# Altium project mo_rong_LoRa_RS485_V2.PrjPcb
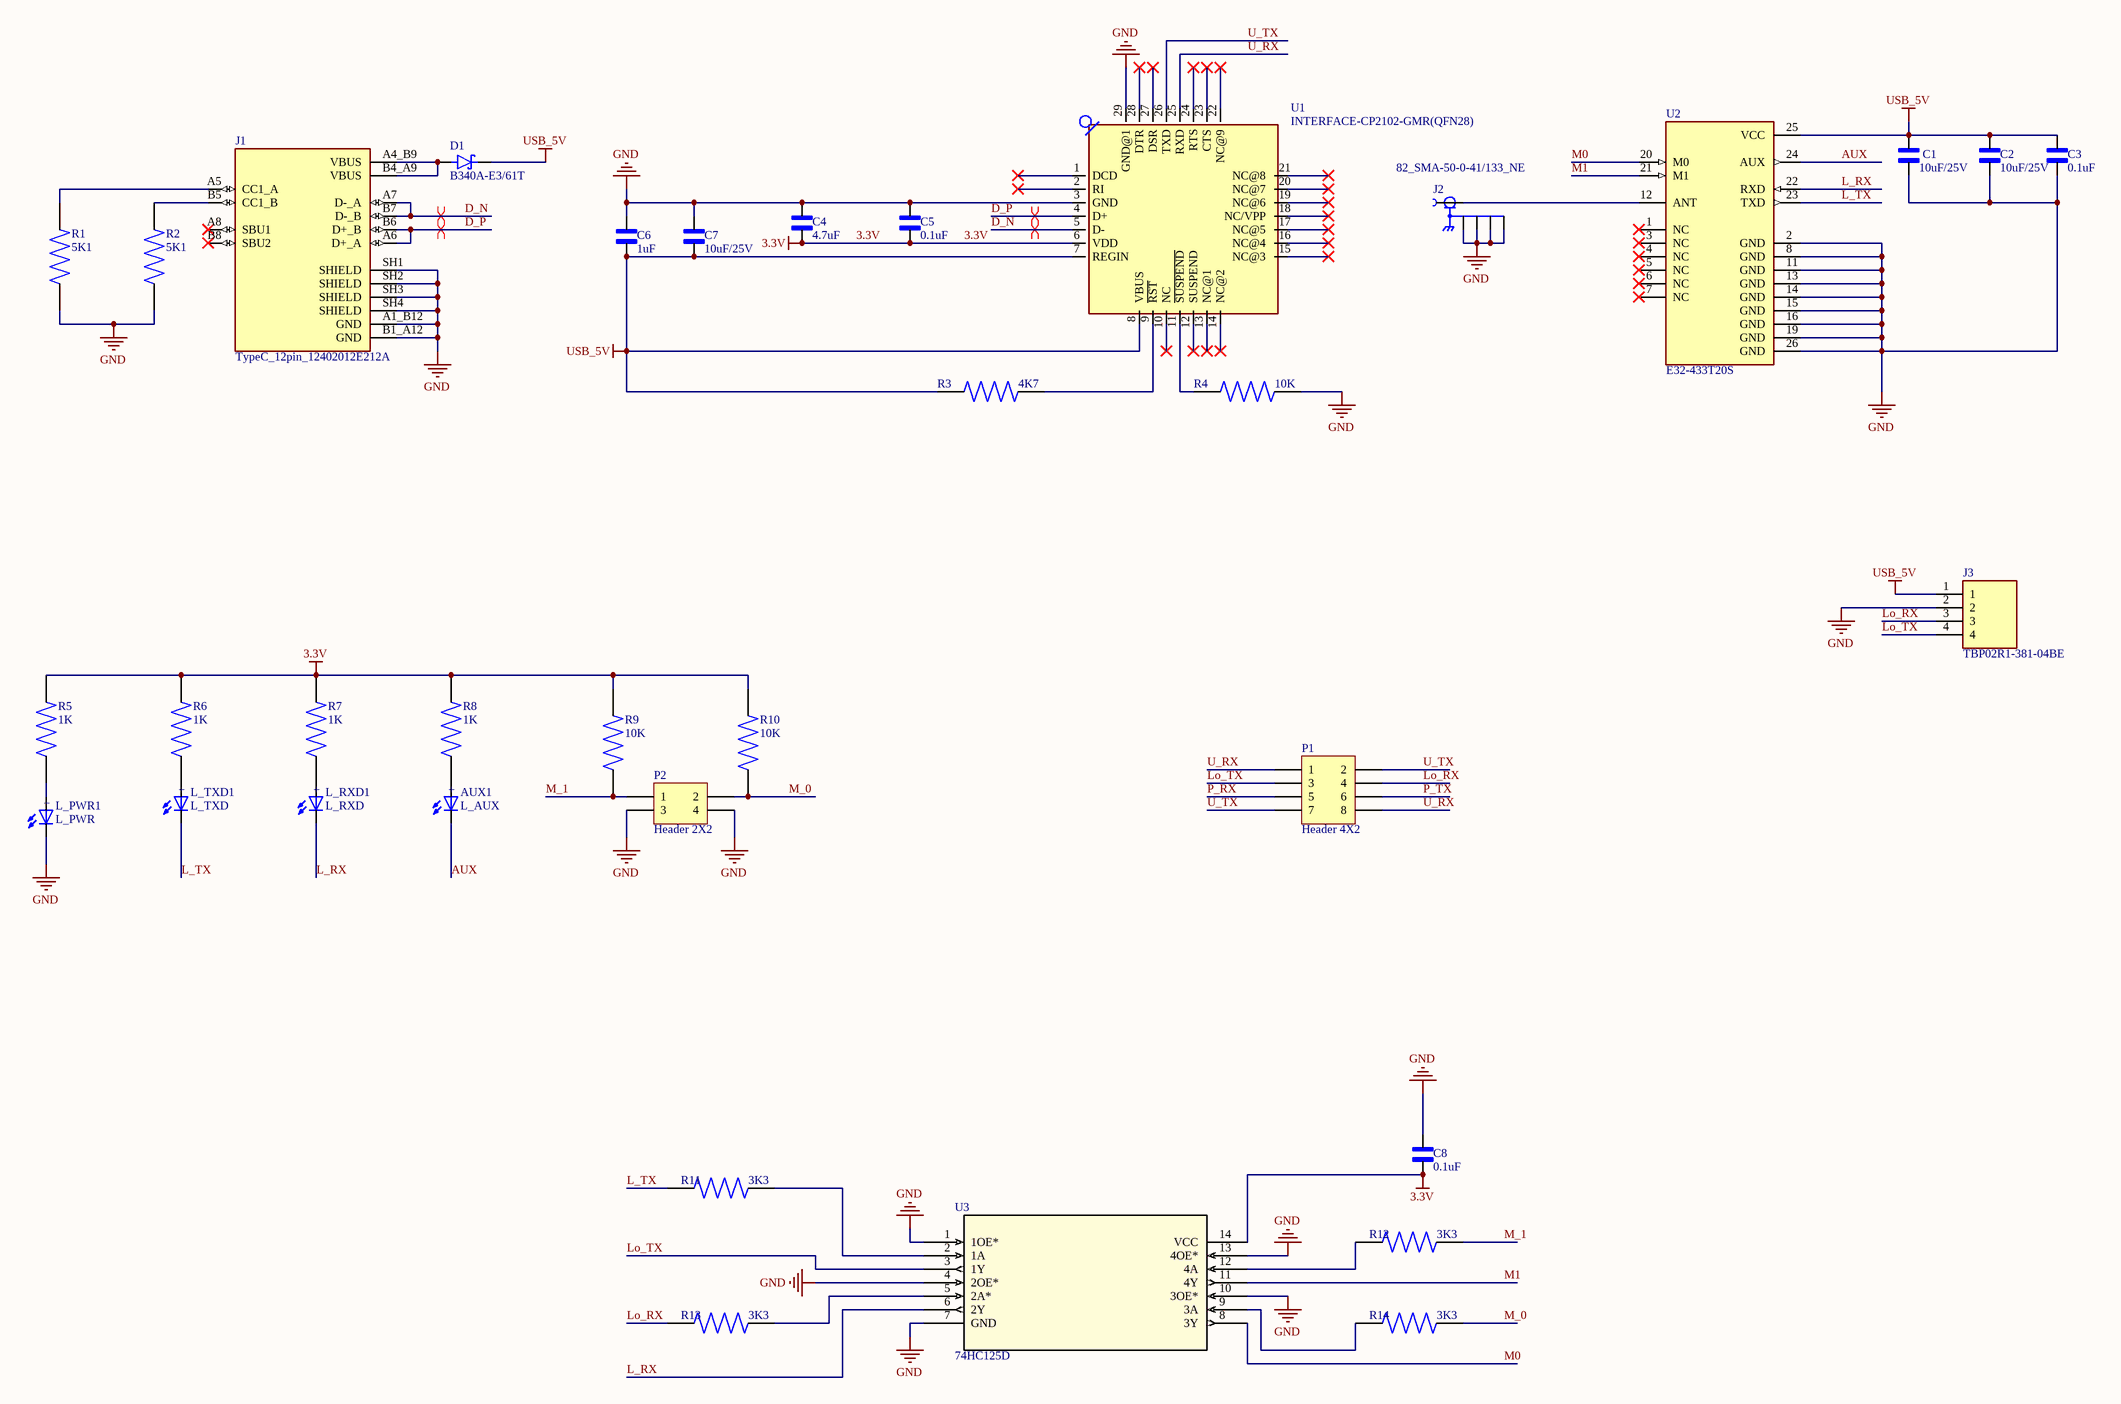
[diagram p0: LoRa_V.SchDoc]
3 sheets, 128 parts. Net scope: global (net labels, ports and power ports of the same name join across sheets).
Board file: mach_mo_rong_v2.PcbDoc
Sheets:
  LoRa_V.SchDoc
  RS_485_V.SchDoc
  connect.SchDoc

## Sheet LoRa_V.SchDoc
size C; SheetNumber: 1; SheetTotal: 3

### Parts
AUX1  L_AUX  [WL-SMCW_1206]
C1  10uF/25V  [CAPC1608X94N]
C2  10uF/25V  [CAPC1608X94N]
C3  0.1uF  [CAPC1608X94N]
C4  4.7uF  [CAPC1608X94N]
C5  0.1uF  [CAPC1608X94N]
C6  1uF  [CAPC1608X94N]
C7  10uF/25V  [CAPC1608X94N]
C8  0.1uF  [CAPC1608X94N]
D1  B340A-E3/61T  [DIOM5126X229N]
J1  TypeC_12pin_12402012E212A  [TypeC_12pin_12402012E212A]
J2  82_SMA-50-0-41/133_NE  [HUBER+SUHNER_82_SMA-50-0-41/133_NE]
J3  TBP02R1-381-04BE  [CUI_TBP02R1-381-04BE]
L_PWR1  L_PWR  [WL-SMCW_1206]
L_RXD1  L_RXD  [WL-SMCW_1206]
L_TXD1  L_TXD  [WL-SMCW_1206]
P1  Header 4X2  [HDR2X4]
P2  Header 2X2  [HDR2X2]
R1  5K1  [RES_ERJU03J474V]
R2  5K1  [RES_ERJU03J474V]
R3  4K7  [RES_ERJU03J474V]
R4  10K  [RES_ERJU03J474V]
R5  1K  [RES_ERJU03J474V]
R6  1K  [RES_ERJU03J474V]
R7  1K  [RES_ERJU03J474V]
R8  1K  [RES_ERJU03J474V]
R9  10K  [RES_ERJU03J474V]
R10  10K  [RES_ERJU03J474V]
R11  3K3  [RES_ERJU03J474V]
R12  3K3  [RES_ERJU03J474V]
R13  3K3  [RES_ERJU03J474V]
R14  3K3  [RES_ERJU03J474V]
U1  INTERFACE-CP2102-GMR(QFN28)  [QFN28G_0.5-5X5MM]
U2  E32-433T20S  [MODULE_E32-433T20S]
U3  74HC125D  [SOT108-1_NEX]

### Nets
3.3V: C4.1 C5.1 C8.2 R5.2 R6.2 R7.2 R8.2 R9.1 R10.1 U1.6(VDD) U3.14(VCC)
GND: C1.1 C2.1 C3.1 C4.2 C5.2 C6.2 C7.2 C8.1 J1.A1_B12(GND) J1.B1_A12(GND) J1.SH1(SHIELD) J1.SH2(SHIELD) J1.SH3(SHIELD) J1.SH4(SHIELD) J2.G1 J2.G2 J2.G3 J2.G4 J3.2 L_PWR1.1(NEG) P2.3 P2.4 R1.1 R2.1 R4.2 U1.3(GND) U1.29(GND@1) U2.2(GND) U2.8(GND) U2.11(GND) U2.13(GND) U2.14(GND) U2.15(GND) U2.16(GND) U2.19(GND) U2.26(GND) U3.1(1OE*) U3.4(2OE*) U3.7(GND) U3.10(3OE*) U3.13(4OE*)
USB_5V: C1.2 C2.2 C3.2 C6.1 C7.1 D1.C J3.1 R3.1 U1.7(REGIN) U1.8(VBUS) U2.25(VCC)  [project net RPI_5V]
AUX: AUX1.1(NEG) U2.24(AUX)
D_N: J1.A7(D-_A) J1.B7(D-_B) U1.5(D-)
D_P: J1.A6(D+_A) J1.B6(D+_B) U1.4(D+)
L_RX: L_RXD1.1(NEG) U2.22(RXD) U3.6(2Y)
L_TX: L_TXD1.1(NEG) R11.1 U2.23(TXD)
Lo_RX: J3.3 P1.4 R13.1
Lo_TX: J3.4 P1.3 U3.3(1Y)
M0: U2.20(M0) U3.8(3Y)
M1: U2.21(M1) U3.11(4Y)
M_0: P2.2 R10.2 R14.2
M_1: P2.1 R9.2 R12.2
P_RX: P1.5
P_TX: P1.6
U_RX: P1.1 P1.8 U1.25(RXD)
U_TX: P1.2 P1.7 U1.26(TXD)
NetAUX1_2: AUX1.2(POS) R8.1
NetD1_A: D1.A J1.A4_B9(VBUS) J1.B4_A9(VBUS)
NetJ1_A5: J1.A5(CC1_A) R1.2
NetJ1_B5: J1.B5(CC1_B) R2.2
NetJ2_1: J2.1 U2.12(ANT)
NetL_PWR1_2: L_PWR1.2(POS) R5.1
NetL_RXD1_2: L_RXD1.2(POS) R7.1
NetL_TXD1_2: L_TXD1.2(POS) R6.1
NetR3_2: R3.2 U1.9(~{RST})
NetR4_1: R4.1 U1.11(~{SUSPEND})
NetR11_2: R11.2 U3.2(1A)
NetR12_1: R12.1 U3.12(4A)
NetR13_2: R13.2 U3.5(2A*)
NetR14_1: R14.1 U3.9(3A)

Not connected (* = marked no-connect by the designer): J1 A8(SBU1)* B8(SBU2)*; U1 1(DCD)* 2(RI)* 10(NC)* 12(SUSPEND)* 13(NC@1)* 14(NC@2)* 15(NC@3)* 16(NC@4)* 17(NC@5)* 18(NC/VPP)* 19(NC@6)* 20(NC@7)* 21(NC@8)* 22(NC@9)* 23(CTS)* 24(RTS)* 27(DSR)* 28(DTR)*; U2 1(NC)* 3(NC)* 4(NC)* 5(NC)* 6(NC)* 7(NC)*

### Layout directives
differential pair: D_N, D_P

### Notes on the sheet
- (in symbol WL-SMCW_1206) +

### Library data of the parts
AUX1 L_PWR1 L_RXD1 L_TXD1 = WL-SMCW_1206: 1206, Blue Typ.(@20mA): 470nm, 145mcd, 3.2V, 140Â° InGaN; MF: Wurth Electronics; MP: 150120BS75000; SnapEDA_Link: https://www.snapeda.com/parts/150120BS75000/Wurth+Electronics/view-part/?ref=snap; Package: 1206 Wurth Electronics; Value: *; Check_prices: https://www.snapeda.com/parts/150120BS75000/Wurth+Electronics/view-part/?ref=eda
C1-C8 = cap_0603_VJ0603D3R9DXCAP: cap 0603 (1608 Metric); MF: Vishay Vitramon; SnapEDA_Link: https://www.snapeda.com/parts/VJ0603D3R9DXCAP/Vishay/view-part/?ref=snap; Package: 1608 Vishay Vitramon; Value: *; MP: VJ0603D3R9DXCAP; Check_prices: https://www.snapeda.com/parts/VJ0603D3R9DXCAP/Vishay/view-part/?ref=eda
D1 = B340A-E3/61T: Diode Schottky 40 V 3A Surface Mount DO-214AC (SMA); MF: Vishay Semiconductor; SnapEDA_Link: https://www.snapeda.com/parts/B340A-E3/61T/Vishay/view-part/?ref=snap; Package: DO-214 Vishay Semiconductor; Value: *; MP: B340A-E3/61T; Check_prices: https://www.snapeda.com/parts/B340A-E3/61T/Vishay/view-part/?ref=eda
J1 = TypeC_12pin_12402012E212A: USB2.0, Type C, Top mount, CH 1.68mm, Dual Row SMT; MF: Amphenol ICC (Commercial Products); MP: 12402012E212A; Price: None; Package: None; Availability: In Stock; SnapEDA_Link: https://www.snapeda.com/parts/12402012E212A/Amphenol/view-part/?ref=snap; Value: *; Check_prices: https://www.snapeda.com/parts/12402012E212A/Amphenol/view-part/?ref=eda; Purchase-URL: https://pricing.snapeda.com/search/part/12402012E212A/?ref=eda
J2 = 82_SMA-50-0-41/133_NE: RF Connectors / Coaxial Connectors, Straight Pcb Jack | HUBER+SUHNER 82_SMA-50-0-41/133_NE; SnapEDA_Link: https://www.snapeda.com/parts/82_SMA-50-0-41/133_NE/Huber%252BSuhner/view-part/?ref=snap; Package: None; Value: *; MF: HUBER+SUHNER; MP: 82_SMA-50-0-41/133_NE; Check_prices: https://www.snapeda.com/parts/82_SMA-50-0-41/133_NE/Huber%252BSuhner/view-part/?ref=eda
J3 = TBP02R1-381-04BE: 2~24 Poles, Pluggable,Receptacle, Horizontal, 3.81 Pitch, Terminal Block Connector; MF: Same Sky; SnapEDA_Link: https://www.snapeda.com/parts/TBP02R1-381-04BE/Same+Sky/view-part/?ref=snap; Package: None; Value: *; MP: TBP02R1-381-04BE; Check_prices: https://www.snapeda.com/parts/TBP02R1-381-04BE/Same+Sky/view-part/?ref=eda
P1 = Header 4X2: Header, 4-Pin, Dual row; LatestRevisionDate: 17-Jul-2002; LatestRevisionNote: Re-released for DXP Platform.; Publisher: Altium Limited
P2 = Header 2X2: Header, 2-Pin, Dual row; LatestRevisionDate: 17-Jul-2002; LatestRevisionNote: Re-released for DXP Platform.; Publisher: Altium Limited
R1-R14 = res_0603_ERJU03J474V: 0603 Anti-Sulfurated; MF: Panasonic; SnapEDA_Link: https://www.snapeda.com/parts/ERJU03J474V/Panasonic/view-part/?ref=snap; Package: 1608-2 Panasonic; Value: *; MP: ERJU03J474V; Check_prices: https://www.snapeda.com/parts/ERJU03J474V/Panasonic/view-part/?ref=eda
U1 = INTERFACE-CP2102-GMR(QFN28): USB Bridge, USB to UART USB 2.0 UART Interface 28-QFN (5x5); MF: Silicon; Price: None; Availability: In Stock; MP: CP2102-GMR; Package: VFQFN-28 Vishay Siliconix; SnapEDA_Link: https://www.snapeda.com/parts/CP2102-GMR/Silicon+Labs/view-part/?ref=snap; Check_prices: https://www.snapeda.com/parts/CP2102-GMR/Silicon+Labs/view-part/?ref=eda; Value: *; Purchase-URL: https://pricing.snapeda.com/search/part/CP2102-GMR/?ref=eda
U2 = E32-433T20S: Wireless serial port module (UART); MF: EBYTE; Check_prices: https://www.snapeda.com/parts/E32-433T20S/EBYTE/view-part/?ref=eda; Package: Package; MP: E32-433T20S; Value: *; SnapEDA_Link: https://www.snapeda.com/parts/E32-433T20S/EBYTE/view-part/?ref=snap; Price: None; Availability: Not in stock
U3 = 74HC125D: Description; Manufacturer_Name: Nexperia; Copyright: Copyright (C) 2025 Ultra Librarian. All rights reserved.; Manufacturer_Part_Number: 74HC125D; RefDes: RefDes; Type: Type

## Sheet RS_485_V.SchDoc
size C; SheetNumber: 2; SheetTotal: 3
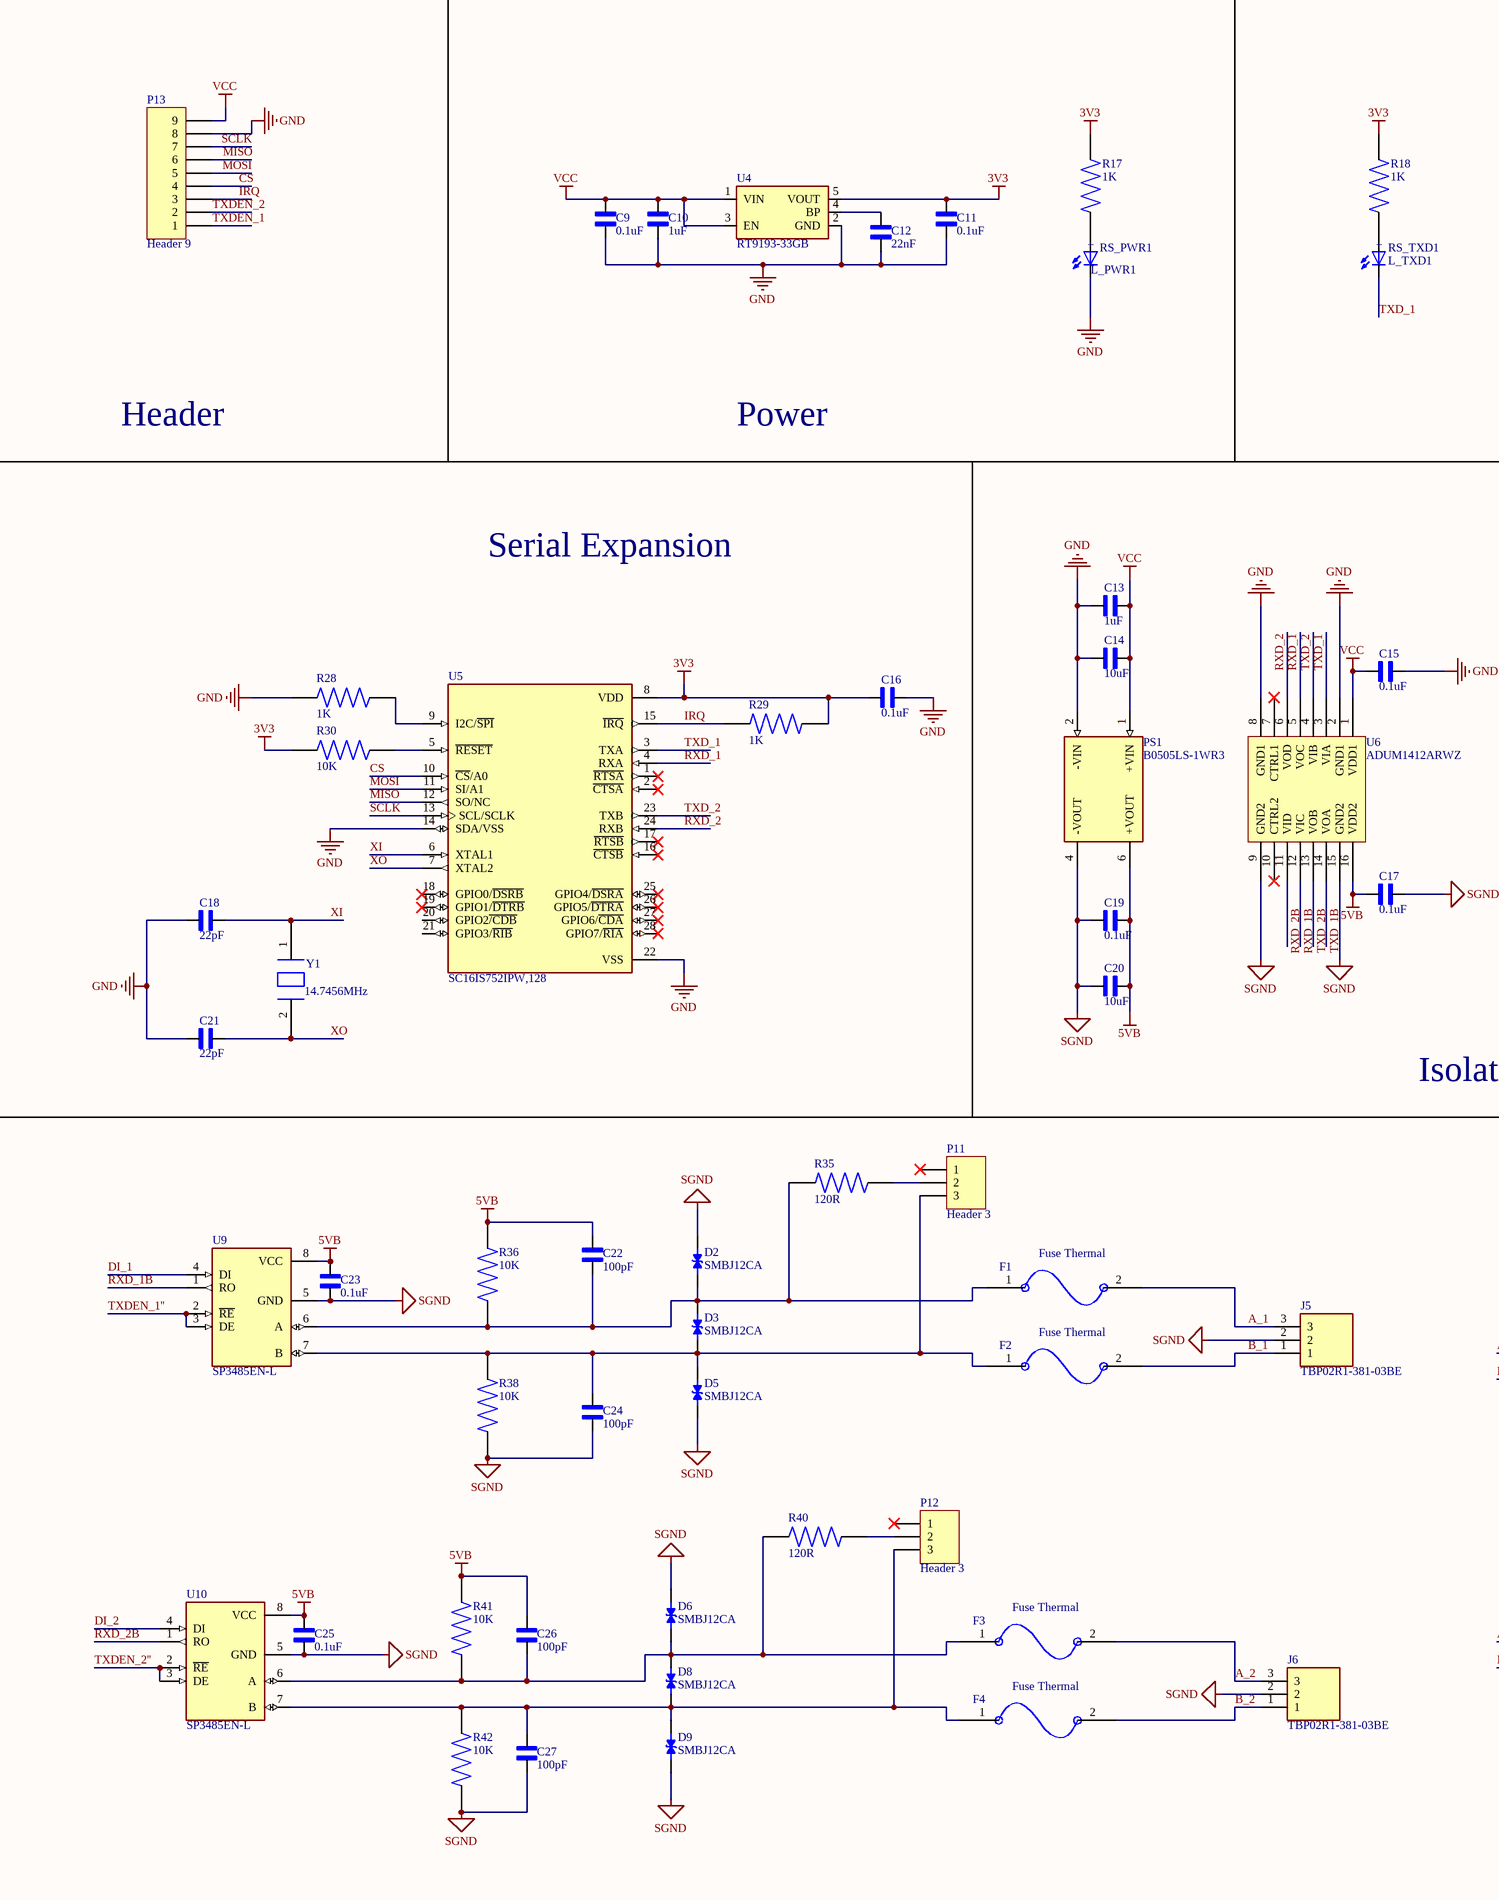
[diagram p1: RS_485_V.SchDoc, left]
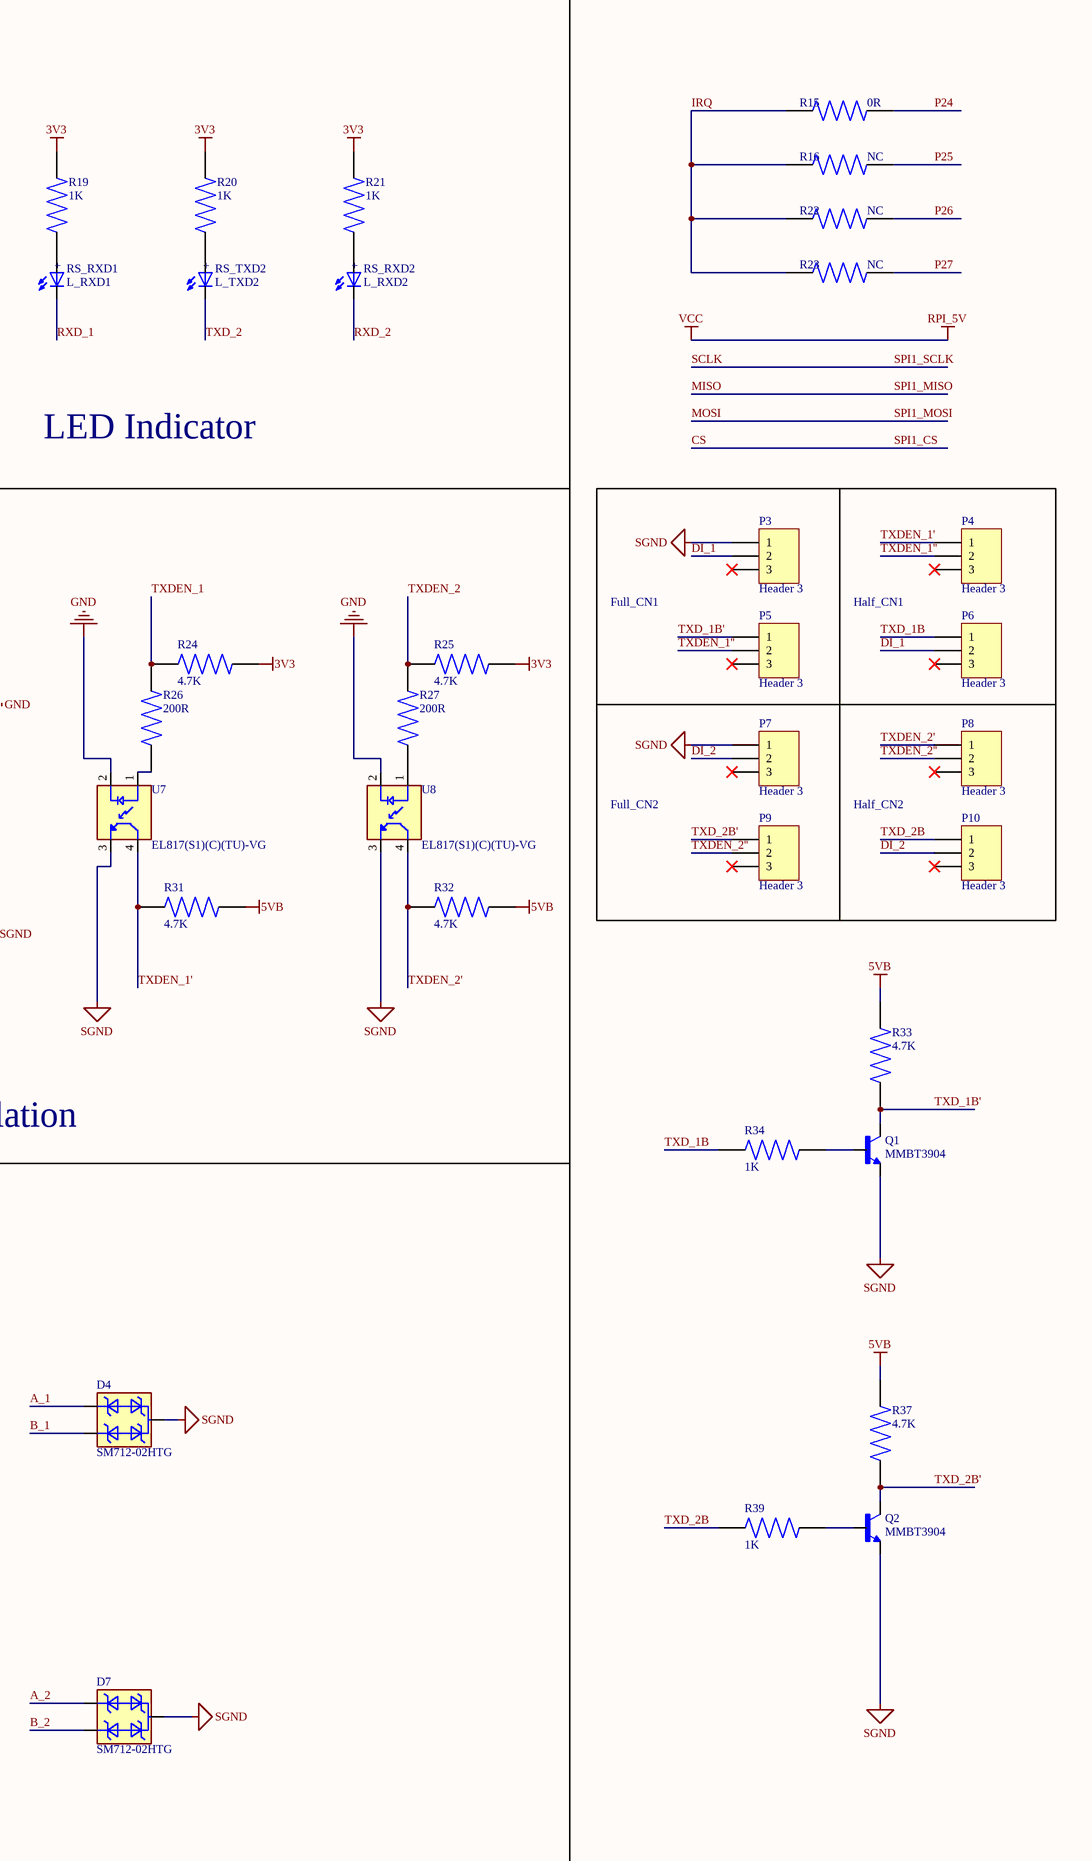
[diagram p2: RS_485_V.SchDoc, right]

### Parts
C9  0.1uF  [CAPC1608X94N]
C10  1uF  [CAPC1608X94N]
C11  0.1uF  [CAPC1608X94N]
C12  22nF  [CAPC1608X94N]
C13  1uF  [CAPC1608X94N]
C14  10uF  [CAPC1608X94N]
C15  0.1uF  [CAPC1608X94N]
C16  0.1uF  [CAPC1608X94N]
C17  0.1uF  [CAPC1608X94N]
C18  22pF  [CAPC1608X94N]
C19  0.1uF  [CAPC1608X94N]
C20  10uF  [CAPC1608X94N]
C21  22pF  [CAPC1608X94N]
C22  100pF  [CAPC1608X94N]
C23  0.1uF  [CAPC1608X94N]
C24  100pF  [CAPC1608X94N]
C25  0.1uF  [CAPC1608X94N]
C26  100pF  [CAPC1608X94N]
C27  100pF  [CAPC1608X94N]
D2  SMBJ12CA  [DIOM4336X265N]
D3  SMBJ12CA  [DIOM4336X265N]
D4  SM712-02HTG  [SOT23]
D5  SMBJ12CA  [DIOM4336X265N]
D6  SMBJ12CA  [DIOM4336X265N]
D7  SM712-02HTG  [SOT23]
D8  SMBJ12CA  [DIOM4336X265N]
D9  SMBJ12CA  [DIOM4336X265N]
F1  Fuse Thermal  [Fuse_thermal]
F2  Fuse Thermal  [Fuse_thermal]
F3  Fuse Thermal  [Fuse_thermal]
F4  Fuse Thermal  [Fuse_thermal]
J5  TBP02R1-381-03BE  [CUI_TBP02R1-381-03BE]
J6  TBP02R1-381-03BE  [CUI_TBP02R1-381-03BE]
P3  Header 3  [HDR1X3]
P4  Header 3  [HDR1X3]
P5  Header 3  [HDR1X3]
P6  Header 3  [HDR1X3]
P7  Header 3  [HDR1X3]
P8  Header 3  [HDR1X3]
P9  Header 3  [HDR1X3]
P10  Header 3  [HDR1X3]
P11  Header 3  [HDR1X3]
P12  Header 3  [HDR1X3]
P13  Header 9  [HDR1X9]
PS1  B0505LS-1WR3  [CONV_RFB-0505S]
Q1  MMBT3904  [TRANS_MMBT3904]
Q2  MMBT3904  [TRANS_MMBT3904]
R15  0R  [RES_ERJU03J474V]
R16  NC  [RES_ERJU03J474V]
R17  1K  [RES_ERJU03J474V]
R18  1K  [RES_ERJU03J474V]
R19  1K  [RES_ERJU03J474V]
R20  1K  [RES_ERJU03J474V]
R21  1K  [RES_ERJU03J474V]
R22  NC  [RES_ERJU03J474V]
R23  NC  [RES_ERJU03J474V]
R24  4.7K  [RES_ERJU03J474V]
R25  4.7K  [RES_ERJU03J474V]
R26  200R  [RES_ERJU03J474V]
R27  200R  [RES_ERJU03J474V]
R28  1K  [RES_ERJU03J474V]
R29  1K  [RES_ERJU03J474V]
R30  10K  [RES_ERJU03J474V]
R31  4.7K  [RES_ERJU03J474V]
R32  4.7K  [RES_ERJU03J474V]
R33  4.7K  [RES_ERJU03J474V]
R34  1K  [RES_ERJU03J474V]
R35  120R  [RES_ERJU03J474V]
R36  10K  [RES_ERJU03J474V]
R37  4.7K  [RES_ERJU03J474V]
R38  10K  [RES_ERJU03J474V]
R39  1K  [RES_ERJU03J474V]
R40  120R  [RES_ERJU03J474V]
R41  10K  [RES_ERJU03J474V]
R42  10K  [RES_ERJU03J474V]
RS_PWR1  L_PWR1  [WL-SMCW_1206]
RS_RXD1  L_RXD1  [WL-SMCW_1206]
RS_RXD2  L_RXD2  [WL-SMCW_1206]
RS_TXD1  L_TXD1  [WL-SMCW_1206]
RS_TXD2  L_TXD2  [WL-SMCW_1206]
U4  RT9193-33GB  [SOT23-5_TEXAS_INSTRUMETNS]
U5  SC16IS752IPW,128  [SOP65P640X110-28N]
U6  ADUM1412ARWZ  [SOIC127P1032X265-16N]
U7  EL817(S1)(C)(TU)-VG  [SOIC254P1030X390-4N_EL817(S1)(C)(TU)-VG]
U8  EL817(S1)(C)(TU)-VG  [SOIC254P1030X390-4N_EL817(S1)(C)(TU)-VG]
U9  SP3485EN-L  [SOIC127P599X175-8N]
U10  SP3485EN-L  [SOIC127P599X175-8N]
Y1  14.7456MHz  [CRY_HC_49_S]

### Nets
3V3: C11.2 C16.1 R17.2 R18.2 R19.2 R20.2 R21.2 R24.1 R25.1 R29.2 R30.1 U4.5(VOUT) U5.8(VDD)
5VB: C17.1 C19.2 C20.2 C22.1 C23.1 C25.1 C26.1 PS1.6(+VOUT) R31.1 R32.1 R33.2 R36.1 R37.2 R41.1 U6.16(VDD2) U9.8(VCC) U10.8(VCC)
GND: C9.1 C10.1 C11.1 C12.1 C13.1 C14.1 C15.2 C16.2 C18.1 C21.1 P13.8 PS1.2(-VIN) R28.1 RS_PWR1.1(NEG) U4.2(GND) U5.14(SDA/VSS) U5.22(VSS) U6.2(GND1) U6.8(GND1) U7.2(C) U8.2(C)
RPI_5V: C9.2 C10.2 C13.2 C14.2 C15.1 P13.9 PS1.1(+VIN) U4.1(VIN) U4.3(EN) U6.1(VDD1)  [also labelled VCC]
SGND: C17.2 C19.1 C20.1 C23.2 C24.2 C25.2 C27.2 D2.2 D4.3 D5.2 D6.2 D7.3 D9.2 J5.2 J6.2 P3.1 P7.1 PS1.4(-VOUT) Q1.2(E) Q2.2(E) R38.2 R42.2 U6.9(GND2) U6.15(GND2) U7.3(ET) U8.3(ET) U9.5(GND) U10.5(GND)
A_1: D4.1 F1.2 J5.3
A_2: D7.1 F3.2 J6.3
B_1: D4.2 F2.2 J5.1
B_2: D7.2 F4.2 J6.1
CS: P13.4 U5.10(~{CS}/A0)  [also labelled SPI1_CS]
DI_1: P3.2 P6.2 U9.4(DI)
DI_2: P7.2 P10.2 U10.4(DI)
IRQ: P13.3 R15.1 R16.1 R22.1 R23.1 R29.1 U5.15(~{IRQ})
MISO: P13.6 U5.12(SO/NC)  [also labelled SPI1_MISO]
MOSI: P13.5 U5.11(SI/A1)  [also labelled SPI1_MOSI]
P24: R15.2
P25: R16.2
P26: R22.2
P27: R23.2
RXD_1: RS_RXD1.1(NEG) U5.4(RXA) U6.5(VOC)
RXD_1B: U6.12(VIC) U9.1(RO)
RXD_2: RS_RXD2.1(NEG) U5.24(RXB) U6.6(VOD)
RXD_2B: U6.11(VID) U10.1(RO)
SCLK: P13.7 U5.13(SCL/SCLK)  [also labelled SPI1_SCLK]
TXD_1: RS_TXD1.1(NEG) U5.3(TXA) U6.3(VIA)
TXD_1B: P6.1 R34.1 U6.14(VOA)
TXD_1B': P5.1 Q1.3(C) R33.1
TXD_2: RS_TXD2.1(NEG) U5.23(TXB) U6.4(VIB)
TXD_2B: P10.1 R39.1 U6.13(VOB)
TXD_2B': P9.1 Q2.3(C) R37.1
TXDEN_1: P13.1 R24.2 R26.2
TXDEN_1': P4.1 R31.2 U7.4(CT)
TXDEN_1'': P4.2 P5.2 U9.2(~{RE}) U9.3(DE)
TXDEN_2: P13.2 R25.2 R27.2
TXDEN_2': P8.1 R32.2 U8.4(CT)
TXDEN_2'': P8.2 P9.2 U10.2(~{RE}) U10.3(DE)
XI: C18.2 U5.6(XTAL1) Y1.1
XO: C21.2 U5.7(XTAL2) Y1.2
NetC12_2: C12.2 U4.4(BP)
NetC22_2: C22.2 D2.1 D3.1 F1.1 R35.1 R36.2 U9.6(A)
NetC24_1: C24.1 D3.2 D5.1 F2.1 P11.3 R38.1 U9.7(B)
NetC26_2: C26.2 D6.1 D8.1 F3.1 R40.1 R41.2 U10.6(A)
NetC27_1: C27.1 D8.2 D9.1 F4.1 P12.3 R42.1 U10.7(B)
NetP11_2: P11.2 R35.2
NetP12_2: P12.2 R40.2
NetQ1_1: Q1.1(B) R34.2
NetQ2_1: Q2.1(B) R39.2
NetR17_1: R17.1 RS_PWR1.2(POS)
NetR18_1: R18.1 RS_TXD1.2(POS)
NetR19_1: R19.1 RS_RXD1.2(POS)
NetR20_1: R20.1 RS_TXD2.2(POS)
NetR21_1: R21.1 RS_RXD2.2(POS)
NetR26_1: R26.1 U7.1(A)
NetR27_1: R27.1 U8.1(A)
NetR28_2: R28.2 U5.9(I2C/~{SPI})
NetR30_2: R30.2 U5.5(~{RESET})

Not connected (* = marked no-connect by the designer): P3 3*; P4 3*; P5 3*; P6 3*; P7 3*; P8 3*; P9 3*; P10 3*; P11 1*; P12 1*; U5 1(~{RTSA})* 2(~{CTSA})* 16(~{CTSB})* 17(~{RTSB})* 18(GPIO0/~{DSRB})* 19(GPIO1/~{DTRB})* 20(GPIO2~{/CDB}) 21(GPIO3/~{RIB}) 25(GPIO4/~{DSRA})* 26(GPIO5/~{DTRA})* 27(GPIO6/~{CDA})* 28(GPIO7/~{RIA})*; U6 7(CTRL1)* 10(CTRL2)*

### Notes on the sheet
- LED Indicator
- Header
- Power
- Serial Expansion
- Full_CN1
- Half_CN1
- Full_CN2
- Half_CN2
- Isolation
- (in symbol WL-SMCW_1206) +

### Library data of the parts
C9-C27 = cap_0603_VJ0603D3R9DXCAP: as C1 on sheet LoRa_V; SnapEDA_Link: https://www.snapeda.com/parts/VJ0603D3R9DXCAP/Vishay/view-part/?ref=snap; Package: 1608 Vishay Vitramon; Value: *; MP: VJ0603D3R9DXCAP; Check_prices: https://www.snapeda.com/parts/VJ0603D3R9DXCAP/Vishay/view-part/?ref=eda
D2 D3 D5 D6 D8 D9 = SMBJ10CA-13-F: MF: {'manufacturer': u'Diodes Incorporated'}; Package: None; Price: None; Value: *; MP: SMBJ10CA-13-F; Availability: Unavailable
D4 D7 = SM712-02HTG: TVS Diode, SM712 Series, 31V Clamp, 600W Peak Pulse, Surface Mount, SOT23-3 | Littelfuse SM712-02HTG; MF: Littelfuse Inc.; SnapEDA_Link: https://www.snapeda.com/parts/SM712-02HTG/Littelfuse/view-part/?ref=snap; Package: SOT-23 Littelfuse Inc.; Value: *; MP: SM712-02HTG; Check_prices: https://www.snapeda.com/parts/SM712-02HTG/Littelfuse/view-part/?ref=eda
F1-F4 = Fuse Thermal: Fuse, Resettable, Fast Acting, 10A, Sz 1206, 0.134x0.071x0.033", SMT, 24VDC, PCB | Bourns MF-NSMF200-2
J5 J6 = TBP02R1-381-03BE: 2~24 Poles, Pluggable,Receptacle, Horizontal, 3.81 Pitch, Terminal Block Connector; MF: Same Sky; SnapEDA_Link: https://www.snapeda.com/parts/TBP02R1-381-03BE/Same+Sky/view-part/?ref=snap; Package: None; Value: *; MP: TBP02R1-381-03BE; Check_prices: https://www.snapeda.com/parts/TBP02R1-381-03BE/Same+Sky/view-part/?ref=eda
P3-P12 = Header 3: Header, 3-Pin; LatestRevisionDate: 17-Jul-2002; LatestRevisionNote: Re-released for DXP Platform.; Publisher: Altium Limited
P13 = Header 9: Header, 9-Pin; LatestRevisionDate: 17-Jul-2002; LatestRevisionNote: Re-released for DXP Platform.; Publisher: Altium Limited
PS1 = B0505LS-1WR3: 1W DC/DC-Converter 'ECONOLINE' SIP7 1kV unreg; MF: Recom Power; MP: RFB-0505S; SnapEDA_Link: https://www.snapeda.com/parts/RFB-0505S/Recom+Power/view-part/?ref=snap; Package: SIP-6 Recom Power; Value: *; Check_prices: https://www.snapeda.com/parts/RFB-0505S/Recom+Power/view-part/?ref=eda
Q1 Q2 = MMBT3904: BJT, SOT-23, 40V, 200mA, NPN, 0.35W, 150Â°C; MF: Diotec Semiconductor; SnapEDA_Link: https://www.snapeda.com/parts/MMBT3904/Diotec/view-part/?ref=snap; Package: SOT-23 Diotec; Value: *; MP: MMBT3904; Check_prices: https://www.snapeda.com/parts/MMBT3904/Diotec/view-part/?ref=eda
R15-R42 = res_0603_ERJU03J474V: 0603 Anti-Sulfurated; MF: Panasonic; SnapEDA_Link: https://www.snapeda.com/parts/ERJU03J474V/Panasonic/view-part/?ref=snap; Package: 1608-2 Panasonic; Value: *; MP: ERJU03J474V; Check_prices: https://www.snapeda.com/parts/ERJU03J474V/Panasonic/view-part/?ref=eda
RS_PWR1 RS_RXD1 RS_RXD2 RS_TXD1 RS_TXD2 = WL-SMCW_1206: as AUX1 on sheet LoRa_V; SnapEDA_Link: https://www.snapeda.com/parts/150120BS75000/Wurth+Electronics/view-part/?ref=snap; Package: 1206 Wurth Electronics; Value: *; Check_prices: https://www.snapeda.com/parts/150120BS75000/Wurth+Electronics/view-part/?ref=eda
U4 = RT9193-33GB: Linear Voltage Regulator IC Positive Fixed 1 Output  300mA SOT-23-5; MF: Richtek Technology Corp; MP: RT919333GB; SnapEDA_Link: https://www.snapeda.com/parts/RT919333GB/Richtek/view-part/?ref=snap; Package: SOT-23-5 Richtek; Value: *; Check_prices: https://www.snapeda.com/parts/RT919333GB/Richtek/view-part/?ref=eda
U5 = SC16IS752IPW,128: RS232, RS485 Controller - IÂ²C, SPI, UART Interface 28-TSSOP; MF: NXP Semiconductors; SnapEDA_Link: https://www.snapeda.com/parts/SC16IS752IPW,128/NXP+Semiconductors/view-part/?ref=snap; Package: TSSOP-28 NXP USA; Value: *; MP: SC16IS752IPW,128; Check_prices: https://www.snapeda.com/parts/SC16IS752IPW,128/NXP+Semiconductors/view-part/?ref=eda
U6 = ADUM1412ARWZ: Quad-Channel Digital Isolator
U7 U8 = EL817(S1)(C)(TU)-VG: Optoisolator Transistor Output 5000Vrms 1 Channel 4-SMD; MF: Everlight Electronics; MP: EL817(S1)(A)(TU)-VG; SnapEDA_Link: https://www.snapeda.com/parts/EL817(S1)(A)(TU)-VG/Everlight/view-part/?ref=snap; Package: NON STANDARD-4 Everlight; Value: *; Check_prices: https://www.snapeda.com/parts/EL817(S1)(A)(TU)-VG/Everlight/view-part/?ref=eda
U9 U10 = SP3485EN-L: 1/1 Transceiver Half RS422, RS485 8-SOIC; MF: MaxLinear, Inc.; SnapEDA_Link: https://www.snapeda.com/parts/SP3485EN-L/MaxLinear/view-part/?ref=snap; Package: None; Value: *; MP: SP3485EN-L; Check_prices: https://www.snapeda.com/parts/SP3485EN-L/MaxLinear/view-part/?ref=eda
Y1 = Thach anh: Crystal For all Crystal 2pin.

## Sheet connect.SchDoc
size B; SheetNumber: 3; SheetTotal: 3
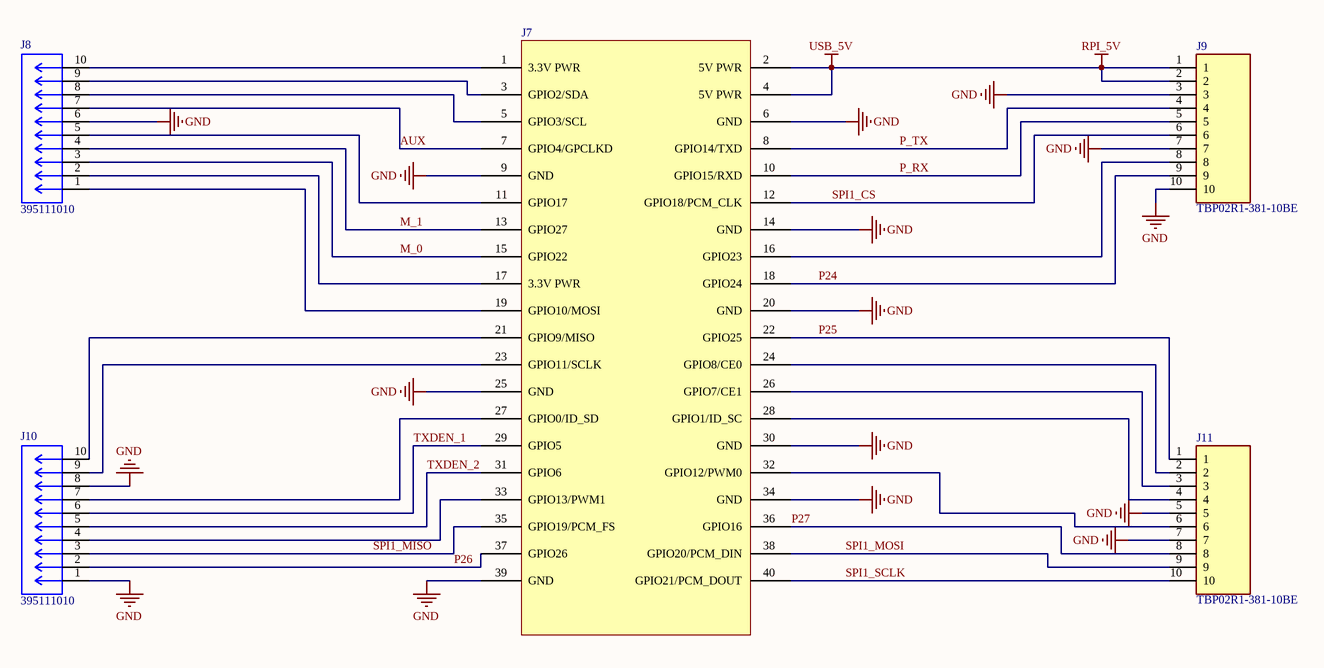
[diagram p3: connect.SchDoc]

### Parts
J7  (no value)  [GPIO_INTERFACE]
J8  395111010  [CONN_SD-39511-001_10P_MOL]
J9  TBP02R1-381-10BE  [CUI_TBP02R1-381-10BE]
J10  395111010  [CONN_SD-39511-001_10P_MOL]
J11  TBP02R1-381-10BE  [CUI_TBP02R1-381-10BE]

### Nets
GND: J7.6(GND) J7.9(GND) J7.14(GND) J7.20(GND) J7.25(GND) J7.30(GND) J7.34(GND) J7.39(GND) J8.6 J9.3 J9.7 J9.10 J10.1 J10.8 J11.5 J11.7
RPI_5V: J7.2(5V_PWR) J7.4(5V_PWR) J9.1 J9.2  [also labelled USB_5V]
AUX: J7.7(GPIO4/GPCLKD) J8.7
M_0: J7.15(GPIO22) J8.3
M_1: J7.13(GPIO27) J8.4
P24: J7.18(GPIO24) J9.9
P25: J7.22(GPIO25) J11.1
P26: J7.37(GPIO26) J10.2
P27: J7.36(GPIO16) J11.8
P_RX: J7.10(GPIO15/RXD) J9.5
P_TX: J7.8(GPIO14/TXD) J9.4
SPI1_CS: J7.12(GPIO18/PCM_CLK) J9.6  [project net CS]
SPI1_MISO: J7.35(GPIO19/PCM_FS) J10.3  [project net MISO]
SPI1_MOSI: J7.38(GPIO20/PCM_DIN) J11.9  [project net MOSI]
SPI1_SCLK: J7.40(GPIO21/PCM_DOUT) J11.10  [project net SCLK]
TXDEN_1: J7.29(GPIO5) J10.6
TXDEN_2: J7.31(GPIO6) J10.5
NetJ7_1: J7.1(3.3V_PWR) J8.10
NetJ7_3: J7.3(GPIO2/SDA) J8.9
NetJ7_5: J7.5(GPIO3/SCL) J8.8
NetJ7_11: J7.11(GPIO17) J8.5
NetJ7_16: J7.16(GPIO23) J9.8
NetJ7_17: J7.17(3.3V_PWR) J8.2
NetJ7_19: J7.19(GPIO10/MOSI) J8.1
NetJ7_21: J7.21(GPIO9/MISO) J10.10
NetJ7_23: J7.23(GPIO11/SCLK) J10.9
NetJ7_24: J7.24(GPIO8/CE0) J11.2
NetJ7_26: J7.26(GPIO7/CE1) J11.3
NetJ7_27: J7.27(GPIO0/ID_SD) J10.7
NetJ7_28: J7.28(GPIO1/ID_SC) J11.4
NetJ7_32: J7.32(GPIO12/PWM0) J11.6
NetJ7_33: J7.33(GPIO13/PWM1) J10.4

### Library data of the parts
J7 = RASPBERRY_INTERFACE
J8 J10 = 395111010: Pluggable Terminal Blocks 3.81MM EURO HEADER V EADER VERT BLK 10CKT; MF: Molex; SnapEDA_Link: https://www.snapeda.com/parts/395111010/Molex/view-part/?ref=snap; Package: None; Value: *; MP: 395111010; Check_prices: https://www.snapeda.com/parts/395111010/Molex/view-part/?ref=eda
J9 J11 = TBP02R1-381-10BE: 2â€“24 Ð¿Ð¾Ð»ÑŽÑÐ°, Ð¿Ð¾Ð´ÐºÐ»ÑŽÑ‡Ð°ÐµÐ¼Ñ‹Ðµ, Ñ Ñ€Ð¾Ð·ÐµÑ‚ÐºÐ¾Ð¹, Ð³Ð¾Ñ€Ð¸Ð·Ð¾Ð½Ñ‚Ð°Ð»ÑŒÐ½Ñ‹Ðµ, Ñ ÑˆÐ°Ð³Ð¾Ð¼ 3,81, ÐºÐ»ÐµÐ¼Ð¼Ð½Ð°Ñ ÐºÐ¾Ð»Ð¾Ð´ÐºÐ°; MF: Same Sky; SnapEDA_Link: https://www.snapeda.com/parts/TBP02R1-381-10BE/Same+Sky/view-part/?ref=snap; Package: None; Value: *; MP: TBP02R1-381-10BE; Check_prices: https://www.snapeda.com/parts/TBP02R1-381-10BE/Same+Sky/view-part/?ref=eda

## Nets that join several sheets
GND: LoRa_V (41 pins), RS_485_V (21 pins), connect (16 pins)
RPI_5V: LoRa_V (11 pins), RS_485_V (10 pins), connect (J7.2 J7.4 J9.1 J9.2)
AUX: LoRa_V (AUX1.1 U2.24), connect (J7.7 J8.7)
CS: RS_485_V (P13.4 U5.10), connect (J7.12 J9.6)
M_0: LoRa_V (P2.2 R10.2 R14.2), connect (J7.15 J8.3)
M_1: LoRa_V (P2.1 R9.2 R12.2), connect (J7.13 J8.4)
MISO: RS_485_V (P13.6 U5.12), connect (J7.35 J10.3)
MOSI: RS_485_V (P13.5 U5.11), connect (J7.38 J11.9)
P24: RS_485_V (R15.2), connect (J7.18 J9.9)
P25: RS_485_V (R16.2), connect (J7.22 J11.1)
P26: RS_485_V (R22.2), connect (J7.37 J10.2)
P27: RS_485_V (R23.2), connect (J7.36 J11.8)
P_RX: LoRa_V (P1.5), connect (J7.10 J9.5)
P_TX: LoRa_V (P1.6), connect (J7.8 J9.4)
SCLK: RS_485_V (P13.7 U5.13), connect (J7.40 J11.10)
TXDEN_1: RS_485_V (P13.1 R24.2 R26.2), connect (J7.29 J10.6)
TXDEN_2: RS_485_V (P13.2 R25.2 R27.2), connect (J7.31 J10.5)